# Altium schematic sheet cc2500.SchDoc: CC2500
size A4; Author: r.rodriguezz; Organization: B105 Laboratory; Address1: Integrated Systems Laboratory; Address2: ETSIT - UPM; Address3: Avda Complutense, 30; Address4: 28040 Madrid Spain
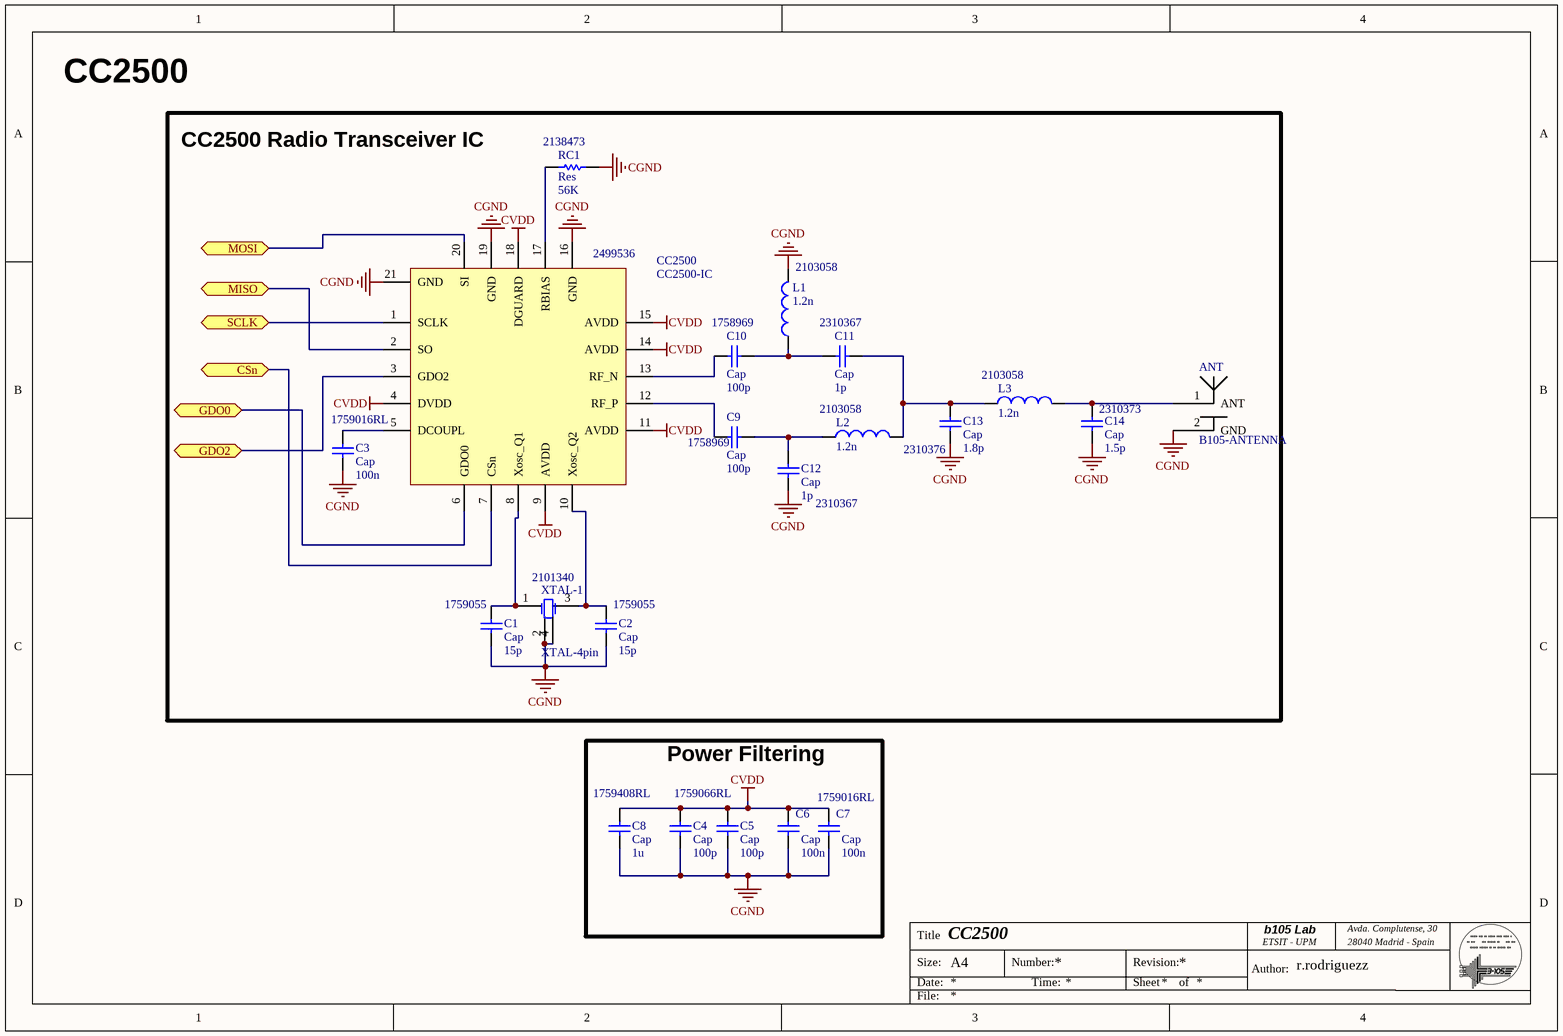
[diagram p0: cc2500.SchDoc]

## Parts
ANT  B105-ANTENNA  [B105-Antenna]
C1  Cap  value 15p  Supplier Part Number 1: 1759055  [0603 Cap]
C2  Cap  value 15p  Supplier Part Number 1: 1759055  [0603 Cap]
C3  Cap  value 100n  Supplier Part Number 1: 1759016RL  [0603 Cap]
C4  Cap  value 100p  Supplier Part Number 1: 1759066RL  [0603 Cap]
C5  Cap  value 100p  [0603 Cap]
C6  Cap  value 100n  [0603 Cap]
C7  Cap  value 100n  Supplier Part Number 1: 1759016RL  [0603 Cap]
C8  Cap  value 1u  Supplier Part Number 1: 1759408RL  [0603 Cap]
C9  Cap  value 100p  Supplier Part Number 1: 1758969  [0402 CAP]
C10  Cap  value 100p  Supplier Part Number 1: 1758969  [0402 CAP]
C11  Cap  value 1p  Supplier Part Number 1: 2310367  [0402 CAP]
C12  Cap  value 1p  Supplier Part Number 1: 2310367  [0402 CAP]
C13  Cap  value 1.8p  Supplier Part Number 1: 2310376  [0402 CAP]
C14  Cap  value 1.5p  Supplier Part Number 1: 2310373  [0402 CAP]
CC2500  CC2500-IC  Supplier Part Number 1: 2499536  [QFN-20]
L1  value 1.2n  Supplier Part Number 1: 2103058  [0402 IND]  (hidden comment: L)
L2  value 1.2n  Supplier Part Number 1: 2103058  [0402 IND]  (hidden comment: L)
L3  value 1.2n  Supplier Part Number 1: 2103058  [0402 IND]  (hidden comment: L)
RC1  Res  value 56K  Supplier Part Number 1: 2138473  [0603 Res]
XTAL-1  XTAL-4pin  Supplier Part Number 1: 2101340  [XTAL-4PIN-3.2x2.5mm]

## Blocks framed on the sheet
CC2500 Radio Transceiver IC: ANT C1-C3 C9-C14 CC2500 L1-L3 RC1 XTAL-1
Power Filtering: C4-C8

## Ports
CSn (bidir), GDO0 (bidir), GDO2 (bidir), MISO (bidir), MOSI (bidir), SCLK (bidir)

## Nets
CGND: ANT.2(GND) C1.1 C2.1 C3.1 C4.1 C5.1 C6.1 C7.1 C8.1 C12.1 C13.1 C14.1 CC2500.16(GND) CC2500.19(GND) CC2500.21(GND) L1.2 RC1.2 XTAL-1.2(GND) XTAL-1.4(GND)
CVDD: C4.2 C5.2 C6.2 C7.2 C8.2 CC2500.4(DVDD) CC2500.9(AVDD) CC2500.11(AVDD) CC2500.14(AVDD) CC2500.15(AVDD) CC2500.18(DGUARD)
CSn: CC2500.7(CSn) ; port CSn
GDO0: CC2500.6(GDO0) ; port GDO0
GDO2: CC2500.3(GDO2) ; port GDO2
MISO: CC2500.2(SO) ; port MISO
MOSI: CC2500.20(SI) ; port MOSI
SCLK: CC2500.1(SCLK) ; port SCLK
NetANT_1: ANT.1(ANT) C14.2 L3.2
NetC1_2: C1.2 CC2500.8(Xosc_Q1) XTAL-1.1(OSC1)
NetC2_2: C2.2 CC2500.10(Xosc_Q2) XTAL-1.3(OSC2)
NetC3_2: C3.2 CC2500.5(DCOUPL)
NetC9_1: C9.1 CC2500.12(RF_P)
NetC9_2: C9.2 C12.2 L2.1
NetC10_1: C10.1 CC2500.13(RF_N)
NetC10_2: C10.2 C11.1 L1.1
NetC11_2: C11.2 C13.2 L2.2 L3.1
NetCC2500_17: CC2500.17(RBIAS) RC1.1

## Notes on the sheet
- Title
- Size:
- Date:
- A4
- Number:
- Time:
- Revision:
- Sheet
- of
- Author:
- ETSIT - UPM
- b105 Lab
- Avda. Complutense, 30
- 28040 Madrid - Spain
- File:

## Library data of the parts
C1 C2 = Cap: Manufacturer: MULTICOMP; Manufacturer Part Number: MC0603N150J500CT; Ceramic Capacitor Case: 0603 [1608 Metric]; Capacitance: 15; Voltage Rating: 50; Capacitance Tolerance: ± 5%; Dielectric Characteristic: C0G / NP0; Product Range: MC Series; SVHC: No SVHC (17-Dec-2015); Capacitor Terminals: SMD; External Depth: 1.6; External Length / Height: 0.8; No. of Pins: 2; Temperature Coefficient: 0ppm/°C ± 30ppm/°C<!--FANDB--><div class="features-and-benefits-container"><div class="features-and-benefits-description"><span class="features-benefits-value">The Multicomp MC series is general purpose MLCC capacitors with C0G (NP0) dielectric material which provides high electrical precision, stability and reliability. This MLCC capacitor consists of a conducting material and electrodes with high density and high efficiency ceramic condensers.</span></div><div class="features-and-benefits-list"><ul class="features-and-benefits-list-list"><li class="features-and-benefits-list-item">Small size with higher capacitance values</li><li class="features-and-benefits-list-item">0201, 0402, 0603, 0805, 1206, 1210, 1812 case sizes available</li><li class="features-and-benefits-list-item">Capacitance value ranging from 0.1pF to 0.1?F</li><li class="features-and-benefits-list-item">Capacitor with lead free termination (pure Tin)</li><li class="features-and-benefits-list-item">High electrical precision, stability and reliability</li><li class="features-and-benefits-list-item">Rated voltage of 10V, 16V, 25V, 50V, 100V</li><li class="features-and-benefits-list-item">Operating temperature of -55°C to +125°C</li><li class="features-and-benefits-list-item">Temperature coefficient (TCR) of ±30; Description 1: MULTICOMP - MC0603N150J500CT - CAP, MLCC, C0G/NP0, 15PF, 50V, 0603; Supplier 1: Farnell; RoHS: YES; Stock 1: 50179; Pricing 1: 10=0.0062, 250=0.005, 500=0.0042, 1000=0.0036, 2000=0.0031 (GBP); Packaging: Cut Tape; Operating Temperature Min: -55; Operating Temperature Max: 125; Automotive Qualification Standard: -; MSL: -; Capacitance Tolerance ±: ± 5%; External Width: 0.8; Operating Temperature Range: -55°C to +125; ComponentLink1URL: http://www.farnell.com/datasheets/1901289.pdf; ComponentLink1Description: http://www.farnell.com/datasheets/1901289.pdf
C3 C6 C7 = Cap: Manufacturer: MULTICOMP; Manufacturer Part Number: MC0603B104K160CT; Ceramic Capacitor Case: 0603 [1608 Metric]; Capacitance: 0.1; Voltage Rating: 16; Capacitance Tolerance: ± 10%; Dielectric Characteristic: X7; Product Range: MC Series; SVHC: No SVHC (17-Dec-2015)<!--FANDB--><div class="features-and-benefits-container"><div class="features-and-benefits-description"><span class="features-benefits-value">The Multicomp MC series is general purpose MLCC capacitors with X7R dielectric material which provides high electrical precision, stability and reliability. This MLCC capacitor consists of a conducting material and electrodes with high density and high efficiency ceramic condensers.</span></div><div class="features-and-benefits-list"><ul class="features-and-benefits-list-list"><li class="features-and-benefits-list-item">Small size with higher capacitance values</li><li class="features-and-benefits-list-item">0201, 0402, 0603, 0805, 1206, 1210, 1812 case sizes available</li><li class="features-and-benefits-list-item">Capacitance value ranging from 100pF to 47?F</li><li class="features-and-benefits-list-item">Capacitor with lead free termination (pure Tin)</li><li class="features-and-benefits-list-item">High electrical precision, stability and reliability</li><li class="features-and-benefits-list-item">Rated voltage of 6.3V, 10V, 16V, 25V, 50V, 100V</li><li class="features-and-benefits-list-item">Operating temperature of -55°C to +125°C</li><li class="features-and-benefits-list-item">Available in ±5%, ±10% and ±20; Description 1: MULTICOMP - MC0603B104K160CT - CAP, MLCC, X7R, 100NF, 16V, 0603; Supplier 1: Farnell; RoHS: YES; Stock 1: 78340; Pricing 1: 10=0.0065, 250=0.0053, 500=0.0044, 1000=0.0038, 2000=0.0033 (GBP); Packaging: Cut Tape; Operating Temperature Min: -55; Operating Temperature Max: 125; Automotive Qualification Standard: -; MSL: -; ComponentLink1URL: http://www.farnell.com/datasheets/1901289.pdf; ComponentLink1Description: http://www.farnell.com/datasheets/1901289.pdf
  C6: Supplier Part Number 1: 1759016RL
C4 C5 = Cap: Manufacturer: MULTICOMP; Manufacturer Part Number: MC0603N101J500CT; Ceramic Capacitor Case: 0603 [1608 Metric]; Capacitance: 100; Voltage Rating: 50; Capacitance Tolerance: ± 5%; Dielectric Characteristic: C0G / NP0; Product Range: MC Series; SVHC: No SVHC (17-Dec-2015); Capacitor Terminals: SMD; External Depth: 1.6; External Length / Height: 0.8; No. of Pins: 2; Temperature Coefficient: 0ppm/°C ± 30ppm/°C<!--FANDB--><div class="features-and-benefits-container"><div class="features-and-benefits-description"><span class="features-benefits-value">The Multicomp MC series is general purpose MLCC capacitors with C0G (NP0) dielectric material which provides high electrical precision, stability and reliability. This MLCC capacitor consists of a conducting material and electrodes with high density and high efficiency ceramic condensers.</span></div><div class="features-and-benefits-list"><ul class="features-and-benefits-list-list"><li class="features-and-benefits-list-item">Small size with higher capacitance values</li><li class="features-and-benefits-list-item">0201, 0402, 0603, 0805, 1206, 1210, 1812 case sizes available</li><li class="features-and-benefits-list-item">Capacitance value ranging from 0.1pF to 0.1?F</li><li class="features-and-benefits-list-item">Capacitor with lead free termination (pure Tin)</li><li class="features-and-benefits-list-item">High electrical precision, stability and reliability</li><li class="features-and-benefits-list-item">Rated voltage of 10V, 16V, 25V, 50V, 100V</li><li class="features-and-benefits-list-item">Operating temperature of -55°C to +125°C</li><li class="features-and-benefits-list-item">Temperature coefficient (TCR) of ±30; Description 1: MULTICOMP - MC0603N101J500CT - CAP, MLCC, C0G/NP0, 100PF, 50V, 0603; Supplier 1: Farnell; RoHS: YES; Stock 1: 24335; Pricing 1: 10=0.0058, 300=0.0047, 500=0.004, 1000=0.0034, 2000=0.0029 (GBP); Packaging: Cut Tape; Operating Temperature Min: -55; Operating Temperature Max: 125; Automotive Qualification Standard: -; MSL: -; Capacitance Tolerance ±: ± 5%; External Width: 0.8; Operating Temperature Range: -55°C to +125; ComponentLink1URL: http://www.farnell.com/datasheets/1901289.pdf; ComponentLink1Description: http://www.farnell.com/datasheets/1901289.pdf
  C5: Supplier Part Number 1: 1759066RL
C8 = Cap: Manufacturer: MULTICOMP; Manufacturer Part Number: MC0603F105Z160CT; Description 1: MULTICOMP - MC0603F105Z160CT - CAP, MLCC, Y5V, 1UF, 0603; Ceramic Capacitor Case: 0603 [1608 Metric]; Capacitance: 1; Voltage Rating: 16; Capacitance Tolerance: +80%, -20%; Dielectric Characteristic: Y5; Product Range: MC Series; SVHC: No SVHC (15-Jun-2015); Capacitor Terminals: SMD; Supplier 1: Farnell; RoHS: YES; Stock 1: 184058; Pricing 1: 10=0.0114, 200=0.0084, 400=0.0074, 1000=0.0066, 2000=0.0055 (GBP); ComponentLink1URL: http://www.farnell.com/datasheets/1901289.pdf; ComponentLink1Description: http://www.farnell.com/datasheets/1901289.pdf; Packaging: Cut Tape; Operating Temperature Min: -30; Operating Temperature Max: 85; Automotive Qualification Standard: -; MSL: -; Capacitance Tolerance ±: +80%, -20%; Operating Temperature Range: -30°C to +85°C<!--FANDB--><div class="features-and-benefits-container"><div class="features-and-benefits-description"><span class="features-benefits-value">The Multicomp MC series is general purpose MLCC capacitors with Y5V dielectric material which provides high electrical precision, stability and reliability. This MLCC capacitor consists of a conducting material and electrodes with high density and high efficiency ceramic condensers.</span></div><div class="features-and-benefits-list"><ul class="features-and-benefits-list-list"><li class="features-and-benefits-list-item">Small size with higher capacitance values</li><li class="features-and-benefits-list-item">0201, 0402, 0603, 0805, 1206, 1210, 1812 case sizes available</li><li class="features-and-benefits-list-item">Capacitance value ranging from 0.01?F to 100?F</li><li class="features-and-benefits-list-item">Capacitor with lead free termination (pure Tin)</li><li class="features-and-benefits-list-item">High electrical precision, stability and reliability</li><li class="features-and-benefits-list-item">Rated voltage of 6.3V, 10V, 16V, 25V, 50V, 100V</li><li class="features-and-benefits-list-item">Operating temperature of -25°C to +85°C</li><li class="features-and-benefits-list-item">Available in ±20% and -20/+80
C9 C10 = Cap: Manufacturer: MULTICOMP; Manufacturer Part Number: MC0402N101J500CT; Ceramic Capacitor Case: 0402 [1005 Metric]; Capacitance: 100; Voltage Rating: 50; Capacitance Tolerance: ± 5%; Dielectric Characteristic: C0G / NP0; Product Range: MC Series; SVHC: No SVHC (17-Dec-2015); Capacitor Terminals: SMD; External Depth: 1; External Length / Height: 0.5; No. of Pins: 2; Temperature Coefficient: 0ppm/°C ± 30ppm/°C<!--FANDB--><div class="features-and-benefits-container"><div class="features-and-benefits-description"><span class="features-benefits-value">The Multicomp MC series is general purpose MLCC capacitors with C0G (NP0) dielectric material which provides high electrical precision, stability and reliability. This MLCC capacitor consists of a conducting material and electrodes with high density and high efficiency ceramic condensers.</span></div><div class="features-and-benefits-list"><ul class="features-and-benefits-list-list"><li class="features-and-benefits-list-item">Small size with higher capacitance values</li><li class="features-and-benefits-list-item">0201, 0402, 0603, 0805, 1206, 1210, 1812 case sizes available</li><li class="features-and-benefits-list-item">Capacitance value ranging from 0.1pF to 0.1?F</li><li class="features-and-benefits-list-item">Capacitor with lead free termination (pure Tin)</li><li class="features-and-benefits-list-item">High electrical precision, stability and reliability</li><li class="features-and-benefits-list-item">Rated voltage of 10V, 16V, 25V, 50V, 100V</li><li class="features-and-benefits-list-item">Operating temperature of -55°C to +125°C</li><li class="features-and-benefits-list-item">Temperature coefficient (TCR) of ±30; Description 1: MULTICOMP - MC0402N101J500CT - CAP, MLCC, C0G/NP0, 100PF, 50V, 0402; Supplier 1: Farnell; RoHS: YES; Stock 1: 21563; Pricing 1: 10=0.0049, 500=0.0039, 1000=0.0033, 2500=0.0024, 5000=0.0019 (GBP); Packaging: Cut Tape; Operating Temperature Min: -55; Operating Temperature Max: 125; Automotive Qualification Standard: -; MSL: -; Capacitance Tolerance ±: ± 5%; External Width: 0.5; Operating Temperature Range: -55°C to +125; ComponentLink1URL: http://www.farnell.com/datasheets/1901289.pdf; ComponentLink1Description: http://www.farnell.com/datasheets/1901289.pdf
C11 C12 = Cap: Manufacturer: MULTICOMP; Manufacturer Part Number: MCRF15N1R0A500CT; Description 1: MULTICOMP - MCRF15N1R0A500CT - CAP, RF, NP0, 1PF, 50V, 0402; Capacitance: 1; Voltage Rating: 50; Product Range: MCRF Series; Capacitance Tolerance: ± 0.05; Capacitor Case Style: 0402 [1005 Metric]; Supplier 1: Farnell; RoHS: YES; Stock 1: 30522; Pricing 1: 10=0.0345, 100=0.0292, 500=0.0253, 2500=0.0184, 5000=0.0175, 10000=0.0166, 50000=0.0141, 100000=0.0125 (GBP); ComponentLink1URL: http://www.farnell.com/datasheets/1825576.pdf; ComponentLink1Description: http://www.farnell.com/datasheets/1825576.pdf; Packaging: Cut Tape; Operating Temperature Max: 125; Automotive Qualification Standard: -; Capacitance Tolerance ±: ± 0.05; Operating Temperature Min: -55
C13 = Cap: Manufacturer: MULTICOMP; Manufacturer Part Number: MCRF15N1R8A500CT; Capacitance: 1.8; Voltage Rating: 50; Product Range: MCRF Series; Capacitance Tolerance: ± 0.05; Capacitor Case Style: 0402 [1005 Metric]; Description 1: MULTICOMP - MCRF15N1R8A500CT - CAP, RF, NP0, 1.8PF, 50V, 0402; Supplier 1: Farnell; RoHS: YES; Stock 1: 35152; Pricing 1: 10=0.0345, 100=0.0292, 500=0.0253, 2500=0.0184, 5000=0.0175, 10000=0.0166, 50000=0.0141, 100000=0.0125 (GBP); Packaging: Cut Tape; Operating Temperature Max: 125; Automotive Qualification Standard: -; Capacitance Tolerance ±: ± 0.05; Operating Temperature Min: -55; ComponentLink1URL: http://www.farnell.com/datasheets/1825576.pdf; ComponentLink1Description: http://www.farnell.com/datasheets/1825576.pdf
C14 = Cap: Manufacturer: MULTICOMP; Manufacturer Part Number: MCRF15N1R5A500CT; Capacitance: 1.5; Voltage Rating: 50; Product Range: MCRF Series; Capacitance Tolerance: ± 0.05; Capacitor Case Style: 0402 [1005 Metric]; Description 1: MULTICOMP - MCRF15N1R5A500CT - CAP, RF, NP0, 1.5PF, 50V, 0402; Supplier 1: Farnell; RoHS: YES; Stock 1: 20092; Pricing 1: 10=0.0434, 100=0.0353, 500=0.0297, 2500=0.0206, 5000=0.0195, 10000=0.0184, 50000=0.0154, 100000=0.0135 (GBP); Packaging: Cut Tape; Operating Temperature Max: 125; Automotive Qualification Standard: -; Capacitance Tolerance ±: ± 0.05; Operating Temperature Min: -55; ComponentLink1URL: http://www.farnell.com/datasheets/1825576.pdf; ComponentLink1Description: http://www.farnell.com/datasheets/1825576.pdf
CC2500 = CC1101-IC: Manufacturer: TEXAS INSTRUMENTS; Manufacturer Part Number: CC2500RGP; Frequency Min: 2.4; Frequency Max: 2.4835; RF / IF Modulation: 2; Data Rate: 500; Receiving Current: 17; RF IC Case Style: QFN; No. of Pins: 20; Supply Voltage Min: 1.8; Supply Voltage Max: 3.6; Transmitting Current: 21.5; Output Power (dBm): 1; Sensitivity dBm: -104; RF Transceiver Applications: ISM/SRD Band Systems, Wireless Keyboard and Mouse, Wireless Voice-Quality Audio; SVHC: No SVHC (15-Jun-2015)<!--FANDB--><div class="features-and-benefits-container"><div class="features-and-benefits-description"><span class="features-benefits-value">The CC2500RGP is a low-power 2.4GHz RF Transceiver designed for low-power wireless applications. The IC is intended for the 2400 to 2483.5MHz ISM (industrial, scientific and medical) and SRD (short range device) frequency band. The RF transceiver is integrated with a highly configurable baseband modem. The modem supports various modulation formats and has a configurable data rate up to 500kBaud. CC2500 provides extensive hardware support for packet handling, data buffering, burst transmissions, clear channel assessment, link quality indication and wake-on-radio. The main operating parameters and the 64-byte transmit/receive FIFOs of CC2500 can be controlled via an SPI interface. In a typical system, the CC2500 will be used together with a microcontroller and a few additional passive components.</span></div><div class="features-and-benefits-list"><ul class="features-and-benefits-list-list"><li class="features-and-benefits-list-item">High sensitivity</li><li class="features-and-benefits-list-item">Low current consumption</li><li class="features-and-benefits-list-item">Programmable output power up to +1dBm</li><li class="features-and-benefits-list-item">Excellent receiver selectivity and blocking performance</li><li class="features-and-benefits-list-item">Programmable data rate from 1.2 to 500kBaud</li><li class="features-and-benefits-list-item">OOK, 2-FSK, GFSK and MSK supported</li><li class="features-and-benefits-list-item">Suitable for frequency hopping and multichannel systems due to a fast settling frequency synthesizer</li><li class="features-and-benefits-list-item">Integrated analogue temperature sensor</li><li class="features-and-benefits-list-item">All registers can be programmed with one burst transfer efficient SPI interface</li><li class="features-and-benefits-list-item">Digital RSSI output</li><li class="features-and-benefits-list-item">Programmable channel filter bandwidth</li><li class="features-and-benefits-list-item">Programmable carrier sense (CS) indicator</li><li class="features-and-benefits-list-item">Optional automatic whitening and de-whitening of data</li><li class="features-and-benefits-list-item">400nA Sleep mode current consumption</li><li class="features-and-benefits-list-item">240?s Fast start-up time from Sleep to RX or TX mode (measured on EM design)</li><li class="features-and-benefits-list-item">Wake-on-radio functionality for automatic low-power RX polling</li><li class="features-and-benefits-list-item">Separate 64; Description 1: TEXAS INSTRUMENTS - CC2500RGP - RF TRANSCEIVER, 2.4-2.4835GHZ, QFN-20; Supplier 1: Farnell; RoHS: YES; Stock 1: 2376; Pricing 1: 1=3.02, 10=2.57, 100=2.5, 250=2.34, 500=2.12, 1000=1.7 (GBP); Operating Temperature Min: -40; Operating Temperature Max: 85; Packaging: Each; Product Range: -; MSL: MSL 3 - 168 hours; ComponentLink1URL: http://www.ti.com/general/docs/lit/getliterature.tsp?genericPartNumber=CC2500&amp;&amp;fileType=pdf; ComponentLink1Description: http://www.ti.com/general/docs/lit/getliterature.tsp?genericPartNumber=CC2500&amp;&amp;fileType=pdf; ComponentLink2URL: http://www.farnell.com/datasheets/2060235.pdf; ComponentLink2Description: http://www.farnell.com/datasheets/2060235.pdf
L1-L3 = Ind: Manufacturer: MULTICOMP; Manufacturer Part Number: MCFT0BT1N2; Product Range: MCFT Series; Inductance: 1.2; DC Current Rating: 700; High Frequency Inductor Case: 0402 [1005 Metric]; Inductor Construction: Thin Film; DC Resistance Max: 0.15; Inductance Tolerance: ± 0.1; Self Resonant Frequency Min: 12; SVHC: No SVHC (15-Jun-2015); Inductor Case Style: 0402 [1005 Metric]<!--FANDB--><div class="features-and-benefits-container"></div>; Description 1: MULTICOMP - MCFT0BT1N2 - INDUCTOR, 0402, 1.2NH, +/-0.1NH; Supplier 1: Farnell; RoHS: YES; Stock 1: 9461; Pricing 1: 10=0.0526, 100=0.0282, 500=0.0196, 2500=0.0141, 5000=0.0123, 10000=0.011, 50000=0.0093, 100000=0.008 (GBP); Packaging: Cut Tape; ComponentLink1URL: http://www.farnell.com/datasheets/1598780.pdf; ComponentLink1Description: http://www.farnell.com/datasheets/1598780.pdf
RC1 = Res: Manufacturer: VISHAY; Manufacturer Part Number: CRCW060356K0FKEA.; Resistance: 56; Voltage Rating: 75; Resistor Case Style: 0603 [1608 Metric]; Power Rating: 100; Resistance Tolerance: ± 1%; Product Range: CRCW Series; Resistor Element Material: Thick Film; Temperature Coefficient: ± 100; Automotive Qualification Standard: AEC-Q200; Resistor Mounting: Surface Mount Device<!--FANDB--><div class="features-and-benefits-container"><div class="features-and-benefits-description"><span class="features-benefits-value">The Vishay D/CRCW e3 series are standard thick film chip resistors. The resistance range includes E96 and E24 decade values from 1ohm to 10Mohm. CRCW e3 series resistors have a pure tin solder contacts on the Ni barrier layer that provides compatibility with reflow soldering process.</span></div><div class="features-and-benefits-list"><ul class="features-and-benefits-list-list"><li class="features-and-benefits-list-item">Automotive grade AEC-Q200 qualified</li><li class="features-and-benefits-list-item">EIA 0402, 0603, 0805, 1206, 1210, 1218, 2010, 2512 standard case sizes available</li><li class="features-and-benefits-list-item">Stability &Delta; Description 1: VISHAY - CRCW060356K0FKEA. - RES, THICK FILM, 56K, 1%, 0.1W, 0603; Supplier 1: Farnell; RoHS: Y-EX; Stock 1: 23200; Pricing 1: 10=0.0101, 250=0.0067, 500=0.006, 1250=0.0052, 2500=0.0046 (GBP); Packaging: Cut Tape; MSL: MSL 1 - Unlimited; ComponentLink1URL: http://www.farnell.com/datasheets/2111203.pdf; ComponentLink1Description: http://www.farnell.com/datasheets/2111203.pdf
XTAL-1 = XTAL-4pin: Manufacturer: ABRACON; Manufacturer Part Number: ABM8G-26.000MHZ-B4Y-T; Frequency Nom: 26; Crystal Case: SMD, 3.2mm x 2.5; Frequency Stability + / -: 30; Load Capacitance: 10; Product Range: ABM8; SVHC: No SVHC (15-Jun-2015); Crystal Mounting Type: SMD; Frequency Stability: ± 30; No. of Pins: 4; Description 1: ABRACON - ABM8G-26.000MHZ-B4Y-T - CRYSTAL, 26MHZ, 10PF, SMD; Supplier 1: Farnell; RoHS: YES; Stock 1: 2214; Pricing 1: 1=0.775, 50=0.565, 100=0.5, 250=0.487, 500=0.473, 1000=0.362, 5000=0.35, 10000=0.338 (GBP); Frequency Tolerance + / -: 30; Operating Temperature Min: -20; Operating Temperature Max: 70; Frequency: 26; Operating Temperature Range: -20°C to +70; Packaging: Cut Tape<!--FANDB--><div class="features-and-benefits-container"><div class="features-and-benefits-description"><span class="features-benefits-value">The ABM8G-26.000MHZ-B4Y-T is a 3.2 x 2.5 x 1mm 30ppm ultra miniature ceramic surface-mount Crystal features glass sealed assures high reliability and high temperature operation, tight tolerance and stability. The ABM8G series crystal for use with the modems, communication, test and thin equipment, PMCIA, wireless and high density applications. It is IR reflow capable.</span></div><div class="features-and-benefits-list"><ul class="features-and-benefits-list-list"><li class="features-and-benefits-list-item">Fundamental operation mode</li><li class="features-and-benefits-list-item">60; ComponentLink1URL: http://www.farnell.com/datasheets/1883677.pdf; ComponentLink1Description: http://www.farnell.com/datasheets/1883677.pdf; ComponentLink2URL: http://www.farnell.com/datasheets/1669357.pdf; ComponentLink2Description: http://www.farnell.com/datasheets/1669357.pdf